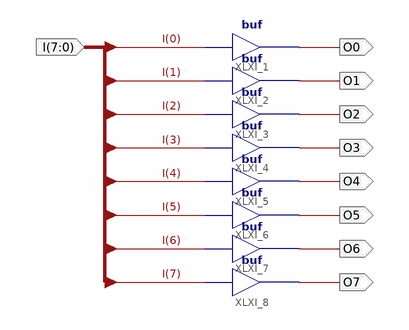
[diagram p0: schematic sheet 1]
// Xilinx ISE schematic btw8.sch (spartan6) as structural Verilog: 8 symbols, 9 ports
module btw8 (
  input  [7:0] I,
  output O0,
  output O1,
  output O2,
  output O3,
  output O4,
  output O5,
  output O6,
  output O7
);

  buf XLXI_1 (O0, I[0]);
  buf XLXI_2 (O1, I[1]);
  buf XLXI_3 (O2, I[2]);
  buf XLXI_4 (O3, I[3]);
  buf XLXI_5 (O4, I[4]);
  buf XLXI_6 (O5, I[5]);
  buf XLXI_7 (O6, I[6]);
  buf XLXI_8 (O7, I[7]);
endmodule
